# Altium schematic sheet 4_PowerSupplie.SchDoc
size 414 x 293 mm; SheetNumber: 4; SheetTotal: 4; PageSetup: Record=PageOptionsZCenterHorizontal=TrueZCenterVertical=TrueZPrintScale=1.00ZXCorrection=0.00ZYCorrection=0.00ZPrintKind=1ZBorderSize=5000000ZLeftOffset=0ZBottomOffset=0ZOrientation=2ZPaperLength=1000ZPaperWidth=1000ZScale=100ZPaperSource=7ZPrintQuality=-4ZMediaType=1ZDitherType=10ZPaperKind=A3ZPrintScaleMode=0; Razrabotal: {Разработал}; Proveril: {Проверил}; Tkontr: {Т.контр.}; Nkontr: {Н.контр.}; Ytverdil: {Утвердил}; Nazvanie1: {Название1}; Nazvanie2: {Название2}; Oboznachenie: {Обозначение}
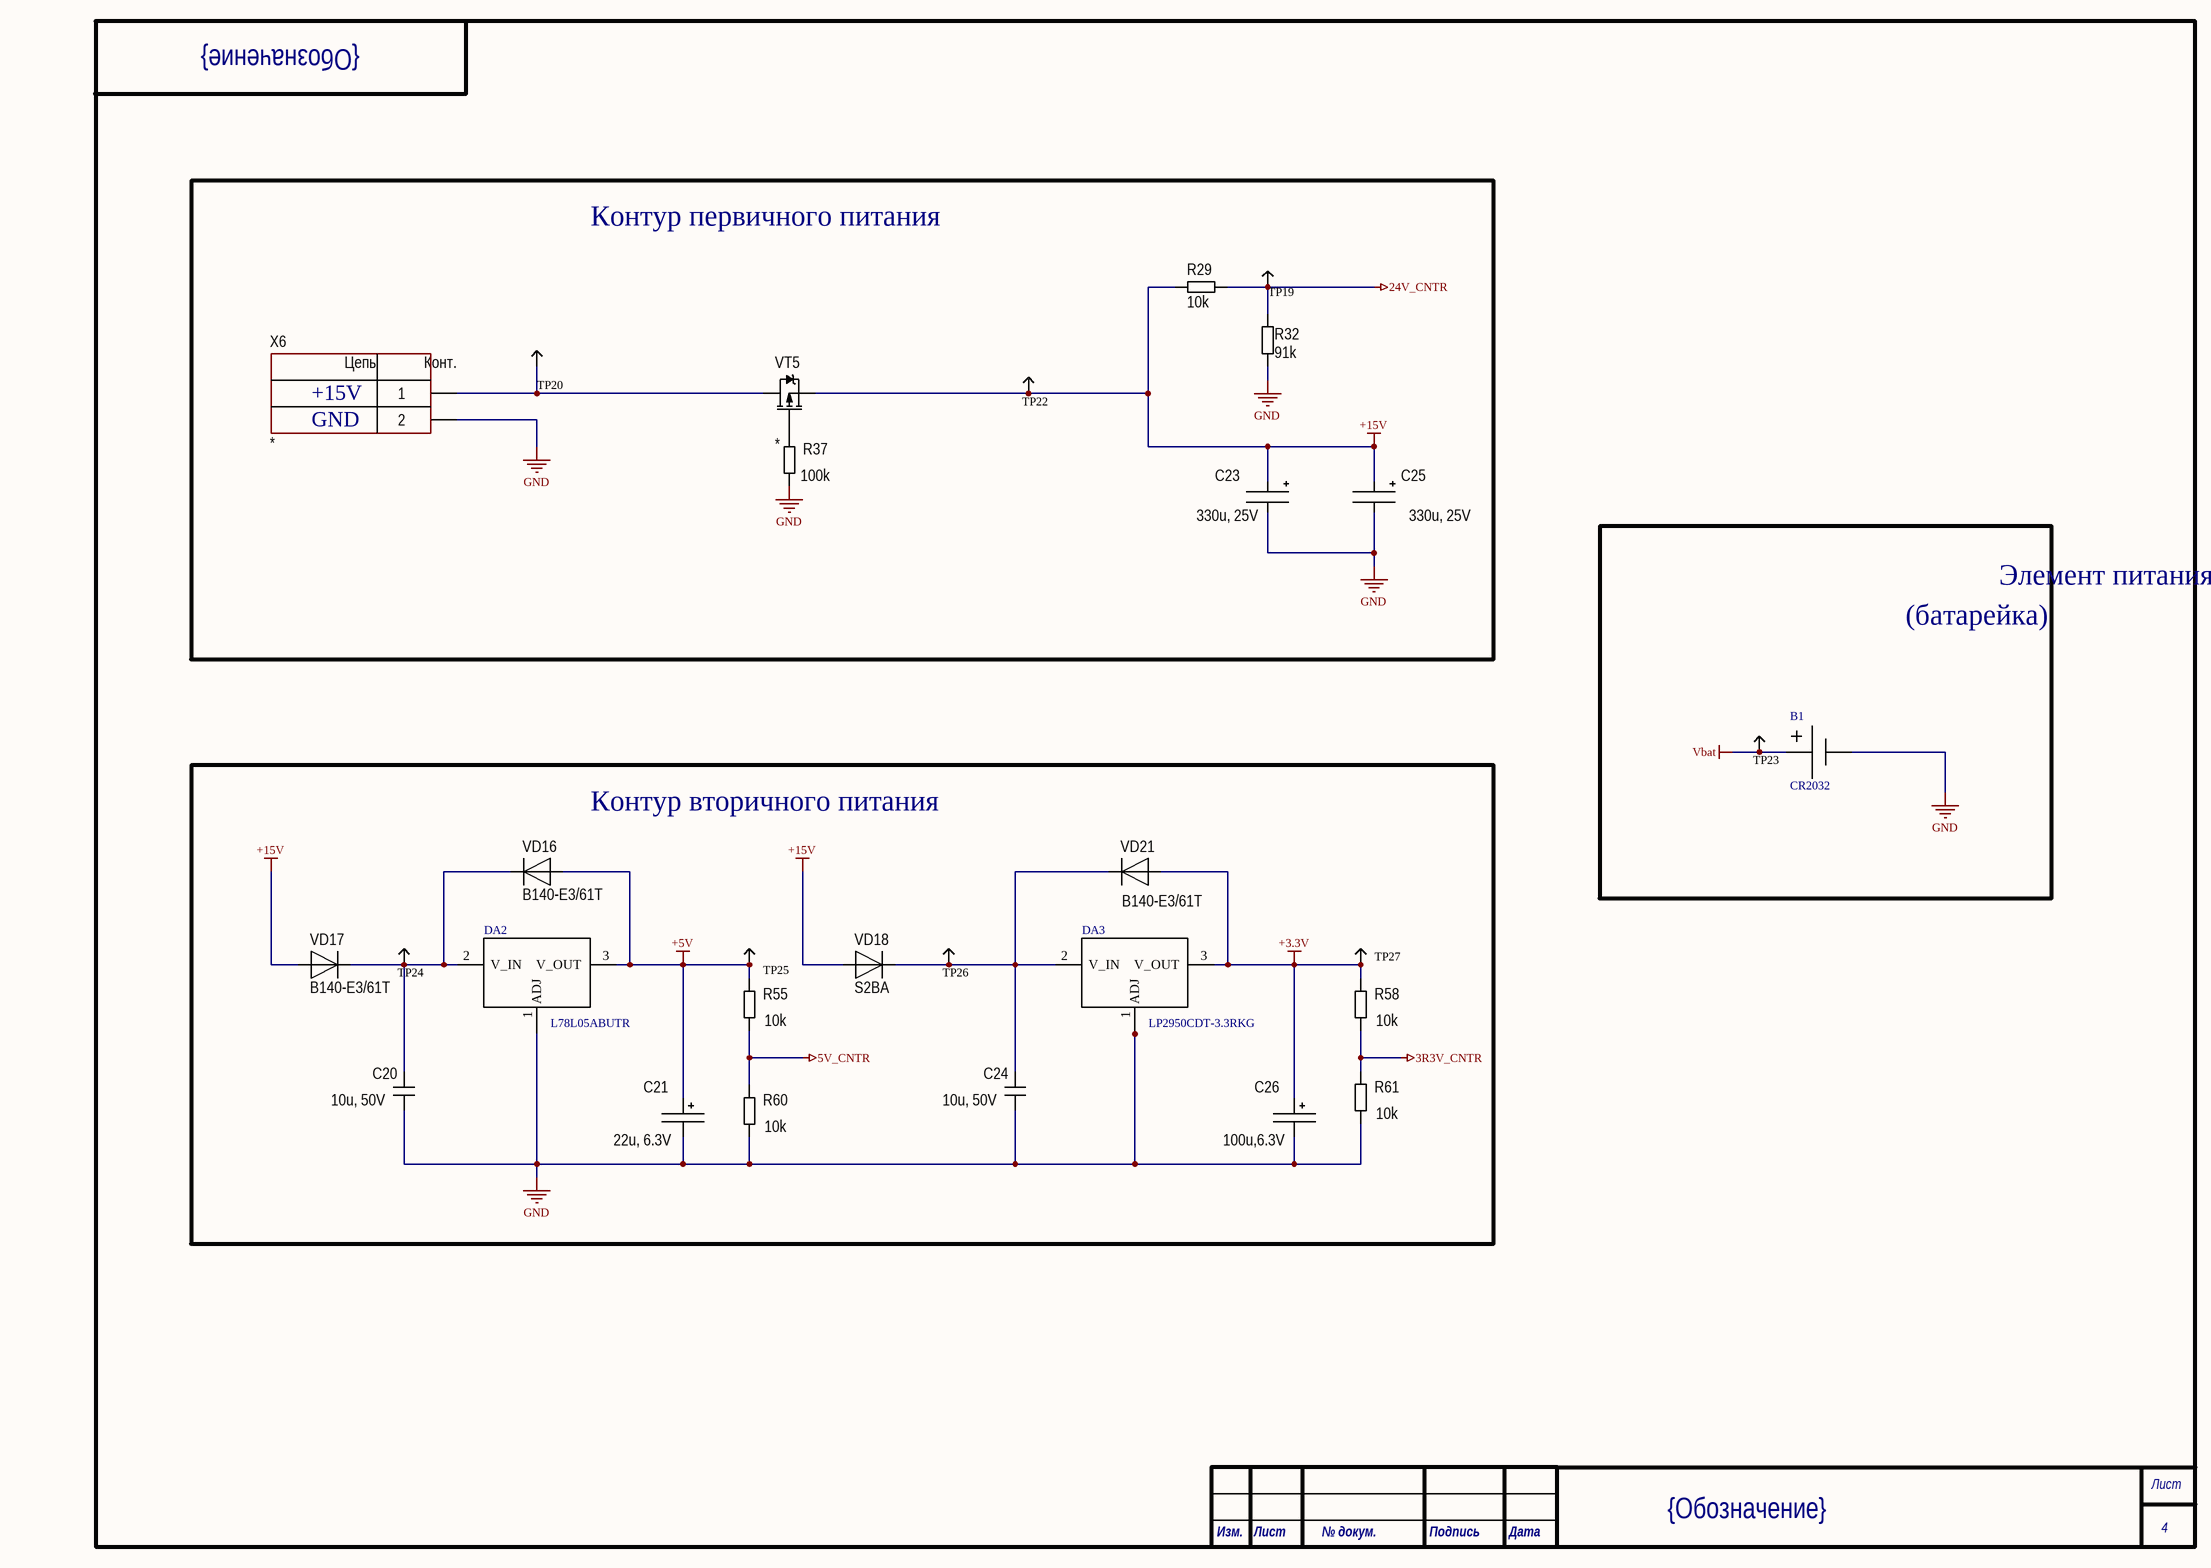
[diagram p0: 4_PowerSupplie.SchDoc]

## Parts
B1  CR2032  [BAT: CR2032_SM]
C20  10u, 50V  [CH1206C]
C21  22u, 6.3V  [TANTAL_A]
C23  330u, 25V  [D10C4.4H10]
C24  10u, 50V  [CH1206C]
C25  330u, 25V  [D10C4.4H10]
C26  100u,6.3V  [TANTAL_B]
DA2  L78L05ABUTR  [SOT89_PC12120]
DA3  LP2950CDT-3.3RKG  [DPAK_213]
R29  10k  [CH0402R]
R32  91k  [CH0402R]
R37  100k  [CH0402R]
R55  10k  [CH0402R]
R58  10k  [CH0402R]
R60  10k  [CH0402R]
R61  10k  [CH0402R]
TP19  (no value)  [TestPoint]
TP20  (no value)  [TestPoint]
TP22  (no value)  [TestPoint]
TP23  (no value)  [TestPoint]
TP24  (no value)  [TestPoint]
TP25  (no value)  [TestPoint]
TP26  (no value)  [TestPoint]
TP27  (no value)  [TestPoint]
VD16  B140-E3/61T  [SMA]
VD17  B140-E3/61T  [SMA]
VD18  S2BA  [SMA]
VD21  B140-E3/61T  [SMA]
VT5  *  [PQFN-3x3]
X6  *  [CON: MX-22-05-3021]

## Blocks framed on the sheet
Контур первичного питания: C23 C25 R29 R32 R37 TP19 TP20 TP22 VT5 X6
Контур вторичного питания: C20 C21 C24 C26 DA2 DA3 R55 R58 R60 R61 TP24-TP27 VD16-VD18 VD21

## Nets
3R3V_CNTR: R58.1 R61.2
5V_CNTR: R55.1 R60.2
24V_CNTR: R29.1 R32.2 TP19.0
+3.3V: C26.1 DA3.3(V_OUT) R58.2 TP27.0 VD21.1
+5V: C21.1 DA2.3(V_OUT) R55.2 TP25.0 VD16.1
+15V: C23.1 C25.1 R29.2 TP22.0 VD17.1 VD18.1 VT5.3(S)
GND: B1.2 C20.1 C21.2 C23.2 C24.1 C25.2 C26.2 DA2.1(ADJ) DA3.1(ADJ) R32.1 R37.1 R60.1 R61.1 X6.2
Vbat: B1.1 TP23.0
NetC20_2: C20.2 DA2.2(V_IN) TP24.0 VD16.2 VD17.2
NetC24_2: C24.2 DA3.2(V_IN) TP26.0 VD18.2 VD21.2
NetR37_2: R37.2 VT5.1(G)
NetTP20_0: TP20.0 VT5.2(D) X6.1

## Notes on the sheet
- +15V
- GND
- (батарейка)
- Элемент питания CR2032
- Лист
- Изм.
- № докум.
- Подпись
- Дата
- (in symbol 2-Connector) Цепь; Конт.

## Library data of the parts
B1 = Battery_CR2032
C20 C24 = Capacitor: Manufacturer: *; Model: *; HelpURL: *; ComponentKind: *; Value: *
C21 C26 = TantalCap: Manufacturer: *; Model: *; HelpURL: *; ComponentKind: *; Value: *
C23 C25 = AlumCap: Manufacturer: *; Model: *; HelpURL: *; ComponentKind: *; Value: *
DA2 DA3 = LM1117
R29 R32 R37 R55 R58 R60 R61 = Resistor: Manufacturer: *; Model: *; HelpURL: *; ComponentKind: *; Value: *
TP19 TP20 TP22-TP27 = TestPoint
VD16-VD18 VD21 = Diod: ComponentKind: *; Manufacturer: *; Model: *; HelpURL: *
VT5 = P-chanel: Mosfet; Model: *; Manufacturer: *; ComponentKind: *; HelpURL: *
X6 = 2-Connector: Model: *; Manufacturer: *; HelpURL: *; ComponentKind: *